# EAGLE design PHONE (EAGLE 6.5.0)
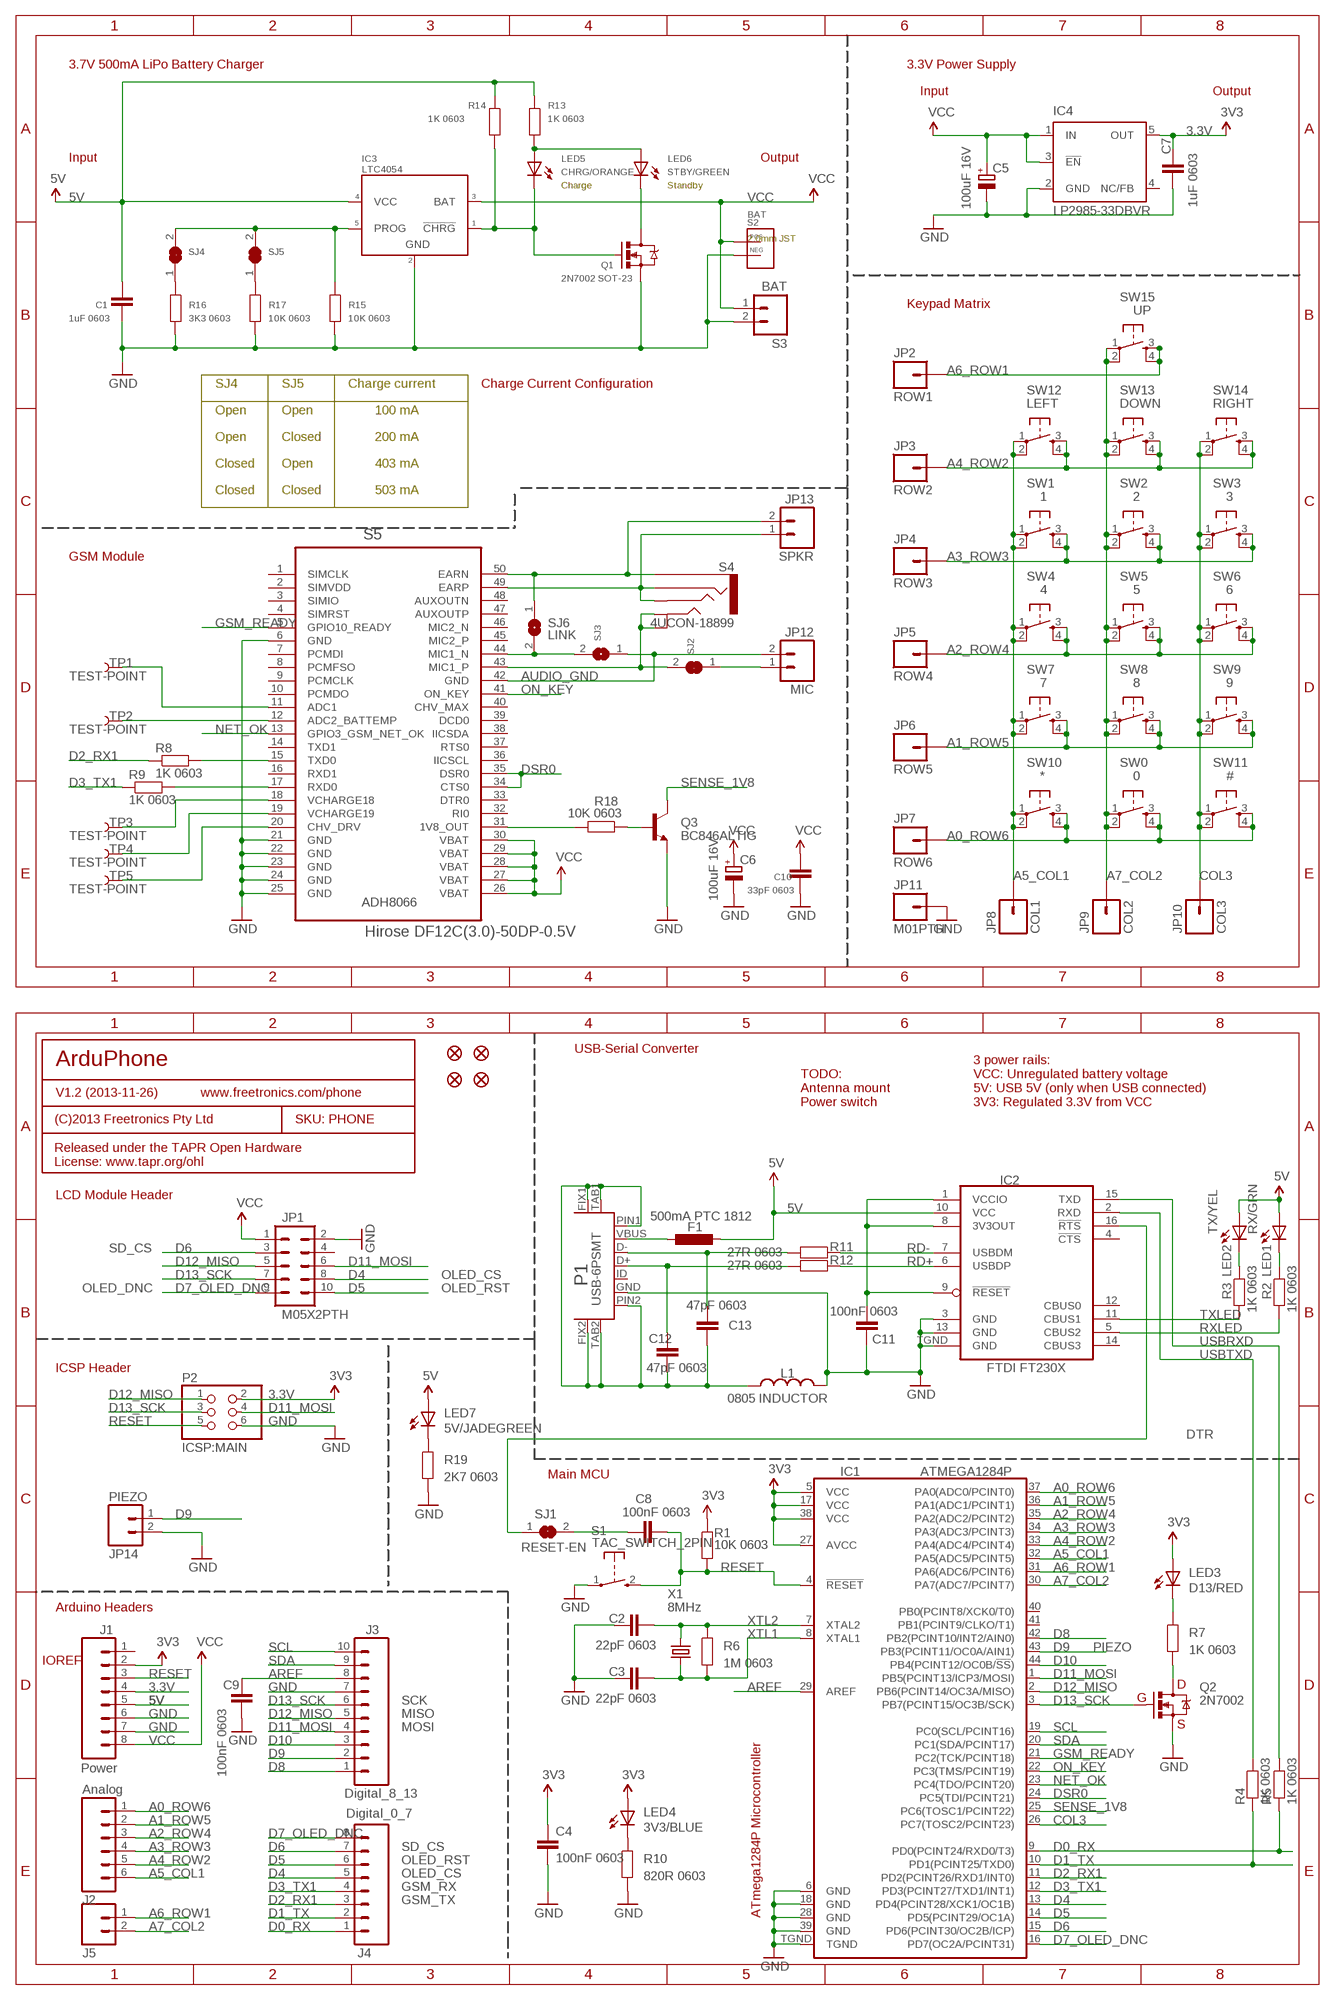
[diagram p0: schematic, sheet 1]

## Parts
C1  1uF 0603  CAP0603  [0603]
C2  22pF 0603  CAP0603  [0603]
C3  22pF 0603  CAP0603  [0603]
C4  100nF 0603  CAP0603  [0603]
C5  100uF 16V  CPOL-EUD  [PANASONIC_D]
C6  100uF 16V  CPOL-EUD  [PANASONIC_D]
C7  1uF 0603  CAP0603  [0603]
C8  100nF 0603  CAP0603  [0603]
C9  100nF 0603  CAP0603  [0603]
C10  33pF 0603  CAP0603  [0603@1]
C11  100nF 0603  CAP0603  [0603]
C12  47pF 0603  C-EUC0603  [C0603]
C13  47pF 0603  C-EUC0603  [C0603]
F1  500mA PTC 1812  L-EUL1812  [L1812]
IC1  ATMEGA1284P  [QFN-44M1]
IC2  FT230X  [QFN-16]
IC3  LTC4054  [SOT23-5]
IC4  LP2985-33DBVR  TEXAS_TPS77033  [TEXAS_SOT23-DBV]
J1  Power  M08  [1X08]
J2  Analog  M06SIP  [1X06]
J3  Digital_8_13  M100.1  [1X10]
J4  Digital_0_7  M08  [1X08]
J5  M02PTH  [1X02]
JP1  M05X2PTH  [AVR_ICSP]
JP2  ROW1  M01PTH  [1X01]
JP3  ROW2  M01PTH  [1X01]
JP4  ROW3  M01PTH  [1X01]
JP5  ROW4  M01PTH  [1X01]
JP6  ROW5  M01PTH  [1X01]
JP7  ROW6  M01PTH  [1X01]
JP8  COL1  M01PTH  [1X01]
JP9  COL2  M01PTH  [1X01]
JP10  COL3  M01PTH  [1X01]
JP11  M01PTH  [1X01]
JP12  MIC  M02PTH  [1X02]
JP13  SPKR  M02PTH  [1X02]
JP14  PIEZO  M02PTH  [1X02]
L1  0805 INDUCTOR  INDUCTOR0805-LARGE  [0805-LARGE]
LED1  RX/GRN  LED0603  [LED-0603]
LED2  TX/YEL  LED0603  [LED-0603]
LED3  D13/RED  LED0603  [LED-0603]
LED4  3V3/BLUE  LED0603  [LED-0603]
LED5  CHRG/ORANGE  LED0603  [LED-0603]
LED6  STBY/GREEN  LED0603  [LED-0603]
LED7  5V/JADEGREEN  LED0603  [LED-0603]
P1  USB-6PSMT  [USB-MICROB-MB05PMXX]
P2  ICSP:MAIN  PINHD-2X3  [2X03]
Q1  2N7002 SOT-23  2N7002  [SOT23-3]
Q2  2N7002  MOSFET-NCHANNELSMD  [SOT23-3]
Q3  BC846ALTIG  TRANSISTOR_NPNSOT23-3  [SOT23-3]
R1  10K 0603  RESISTOR0603  [0603]
R2  1K 0603  RESISTOR0603  [0603]
R3  1K 0603  RESISTOR0603  [0603]
R4  1K 0603  RESISTOR0603  [0603]
R5  1K 0603  RESISTOR0603  [0603]
R6  1M 0603  RESISTOR0603  [0603]
R7  1K 0603  RESISTOR0603  [0603]
R8  1K 0603  RESISTOR0603  [0603]
R9  1K 0603  RESISTOR0603  [0603]
R10  820R 0603  RESISTOR0603  [0603]
R11  27R 0603  RESISTOR0603  [0603]
R12  27R 0603  RESISTOR0603  [0603]
R13  1K 0603  RESISTOR0603  [0603]
R14  1K 0603  RESISTOR0603  [0603]
R15  10K 0603  RESISTOR0603  [0603]
R16  3K3 0603  RESISTOR0603  [0603]
R17  10K 0603  RESISTOR0603  [0603]
R18  10K 0603  RESISTOR0603  [0603]
R19  2K7 0603  RESISTOR0603  [0603]
S1  TAC_SWITCH_2PIN  [TACTILE_SWITCH_SMD_2PIN_TINY]
S2  BAT  2P-JST-TH-RAPTH  [JST-2MM-TH-RA]
S3  BAT  M02PTH  [1X02]
S4  4UCON-18899  AUDIO-JACK-4POLE  [4UCON-18899]
S5  Hirose DF12C(3.0)-50DP-0.5V  ADH8066  [ADH8066]
SJ1  RESET-EN  SJCN  [SJC]
SJ2  SJCN  [SJC]
SJ3  SJ  [SJ]
SJ4  SJCN  [SJC]
SJ5  SJCN  [SJC]
SJ6  LINK  SJ  [SJ]
SW0  0  TAC_SWITCHPTH  [TACTILE-PTH]
SW1  1  TAC_SWITCHPTH  [TACTILE-PTH]
SW2  2  TAC_SWITCHPTH  [TACTILE-PTH]
SW3  3  TAC_SWITCHPTH  [TACTILE-PTH]
SW4  4  TAC_SWITCHPTH  [TACTILE-PTH]
SW5  5  TAC_SWITCHPTH  [TACTILE-PTH]
SW6  6  TAC_SWITCHPTH  [TACTILE-PTH]
SW7  7  TAC_SWITCHPTH  [TACTILE-PTH]
SW8  8  TAC_SWITCHPTH  [TACTILE-PTH]
SW9  9  TAC_SWITCHPTH  [TACTILE-PTH]
SW10  *  TAC_SWITCHPTH  [TACTILE-PTH]
SW11  #  TAC_SWITCHPTH  [TACTILE-PTH]
SW12  LEFT  TAC_SWITCHPTH  [TACTILE-PTH]
SW13  DOWN  TAC_SWITCHPTH  [TACTILE-PTH]
SW14  RIGHT  TAC_SWITCHPTH  [TACTILE-PTH]
SW15  UP  TAC_SWITCHPTH  [TACTILE-PTH]
TP1  TEST-POINT  TEST-POINT2  [PAD.02X.02]
TP2  TEST-POINT  TEST-POINT2  [PAD.02X.02]
TP3  TEST-POINT  TEST-POINT2  [PAD.02X.02]
TP4  TEST-POINT  TEST-POINT2  [PAD.02X.02]
TP5  TEST-POINT  TEST-POINT2  [PAD.02X.02]
U$5  FIDUCIAL1X2.5  [FIDUCIAL-1X2.5]
U$6  FIDUCIAL1X2.5  [FIDUCIAL-1X2.5]
U$7  FIDUCIAL1X2.5  [FIDUCIAL-1X2.5]
U$14  FIDUCIAL1X2.5  [FIDUCIAL-1X2.5]
X1  8MHz  CRYSTALHC49UV  [HC49U-V]

## Nets
3.3V: C4.1 C7.2 IC1.5(VCC) IC1.17(VCC) IC1.27(AVCC) IC1.38(VCC) IC4.5(OUT) J1.2 J1.4 LED3.A LED4.A P2.2 R1.2 ; supply symbol labelled 3V3
5V: C1.2 F1.2 IC2.10(VCC) IC3.4(VCC) J1.5 LED1.A LED2.A LED7.A R13.1 R14.1
A0_ROW6: IC1.37(PA0(ADC0/PCINT0)) J2.1 JP7.1 SW0.3 SW0.4 SW10.3 SW10.4 SW11.3 SW11.4
A1_ROW5: IC1.36(PA1(ADC1/PCINT1)) J2.2 JP6.1 SW7.3 SW7.4 SW8.3 SW8.4 SW9.3 SW9.4
A2_ROW4: IC1.35(PA2(ADC2/PCINT2)) J2.3 JP5.1 SW4.3 SW4.4 SW5.3 SW5.4 SW6.3 SW6.4
A3_ROW3: IC1.34(PA3(ADC3/PCINT3)) J2.4 JP4.1 SW1.3 SW1.4 SW2.3 SW2.4 SW3.3 SW3.4
A4_ROW2: IC1.33(PA4(ADC4/PCINT4)) J2.5 JP3.1 SW12.3 SW12.4 SW13.3 SW13.4 SW14.3 SW14.4
A5_COL1: IC1.32(PA5(ADC5/PCINT5)) J2.6 JP8.1 SW1.1 SW1.2 SW4.1 SW4.2 SW7.1 SW7.2 SW10.1 SW10.2 SW12.1 SW12.2
A6_ROW1: IC1.31(PA6(ADC6/PCINT6)) J5.1 JP2.1 SW15.3 SW15.4
A7_COL2: IC1.30(PA7(ADC7/PCINT7)) J5.2 JP9.1 SW0.1 SW0.2 SW2.1 SW2.2 SW5.1 SW5.2 SW8.1 SW8.2 SW13.1 SW13.2 SW15.1 SW15.2
AREF: C9.1 IC1.29(AREF) J3.8
AUDIO_GND: JP12.2 S5.42(GND) SJ3.1
COL3: IC1.26(PC7(TOSC2/PCINT23)) JP10.1 SW3.1 SW3.2 SW6.1 SW6.2 SW9.1 SW9.2 SW11.1 SW11.2 SW14.1 SW14.2
D0_RX: IC1.9(PD0(PCINT24/RXD0/T3)) J4.1 R5.1
D1_TX: IC1.10(PD1(PCINT25/TXD0)) J4.2 R4.1
D2_RX1: IC1.11(PD2(PCINT26/RXD1/INT0)) J4.3 R8.1
D3_TX1: IC1.12(PD3(PCINT27/TXD1/INT1)) J4.4 R9.1
D4: IC1.13(PD4(PCINT28/XCK1/OC1B)) J4.5 JP1.8
D5: IC1.14(PD5(PCINT29/OC1A)) J4.6 JP1.10
D6: IC1.15(PD6(PCINT30/OC2B/ICP)) J4.7 JP1.3
D7_OLED_DNC: IC1.16(PD7(OC2A/PCINT31)) J4.8 JP1.9
D8: IC1.42(PB2(PCINT10/INT2/AIN0)) J3.1
D9: IC1.43(PB3(PCINT11/OC0A/AIN1)) J3.2 JP14.1
D10: IC1.44(PB4(PCINT12/OC0B/!SS!)) J3.3
D11_MOSI: IC1.1(PB5(PCINT13/ICP3/MOSI)) J3.4 JP1.6 P2.4
D12_MISO: IC1.2(PB6(PCINT14/OC3A/MISO)) J3.5 JP1.5 P2.1
D13_SCK: IC1.3(PB7(PCINT15/OC3B/SCK)) J3.6 JP1.7 P2.3 Q2.1(G)
DSR0: IC1.24(PC5(TDI/PCINT21)) S5.34(CTS0) S5.35(DSR0)
DTR: IC2.16(!RTS) SJ1.1
GND: C1.1 C2.1 C3.1 C4.2 C5.- C6.- C7.1 C9.2 C10.1 C11.2 IC1.6(GND) IC1.18(GND) IC1.28(GND) IC1.39(GND) IC1.TGND IC2.3(GND) IC2.13(GND) IC2.TGND(GND) IC3.2(GND) IC4.2(GND) J1.6 J1.7 J3.7 JP1.2 JP11.1 JP14.2 L1.2 P1.GND P2.6 Q1.2(S) Q2.2(S) Q3.2(E) R10.1 R15.2 R16.2 R17.2 R19.1 S1.1(P) S2.NEG S3.2 S5.6(GND) S5.21(GND) S5.22(GND) S5.23(GND) S5.24(GND) S5.25(GND)
GSM_READY: IC1.21(PC2(TCK/PCINT18)) S5.5(GPIO10_READY)
N$1: C8.1 SJ1.2
N$2: C11.1 IC2.1(VCCIO) IC2.8(3V3OUT) IC2.9(!RESET)
N$3: C12.2 C13.2 L1.1 P1.FIX1 P1.FIX2 P1.PIN1 P1.PIN2 P1.TAB1 P1.TAB2
N$4: LED3.C R7.2
N$5: LED6.C Q1.3(D)
N$6: Q2.3(D) R7.1
N$7: LED7.C R19.2
N$8: LED5.A LED6.A R13.2
N$9: S4.2A S4.2B S5.43(MIC1_P) SJ2.2
N$10: IC3.1(!CHRG) LED5.C Q1.1(G) R14.2
N$11: LED1.C R2.2
N$12: IC3.5(PROG) R15.1 SJ4.2 SJ5.2
N$13: LED2.C R3.2
N$14: LED4.C R10.2
N$15: Q3.1(B) R18.1
N$16: C12.1 P1.D+ R12.2
N$17: C13.1 P1.D- R11.2
N$18: S5.44(MIC1_N) SJ3.2 SJ6.2
N$19: JP13.2 S4.1 S5.50(EARN) SJ6.1
N$20: JP13.1 S4.3 S4.4 S5.49(EARP)
N$21: R8.2 S5.15(TXD0)
N$22: R9.2 S5.17(RXD0)
N$23: S5.18(VCHARGE18) TP3.P$1
N$24: S5.19(VCHARGE19) TP4.P$1
N$25: S5.20(CHV_DRV) TP5.P$1
N$26: R18.2 S5.31(1V8_OUT)
N$27: JP12.1 SJ2.1
N$30: S5.11(ADC1) TP1.P$1
N$31: S5.12(ADC2_BATTEMP) TP2.P$1
N$33: R16.1 SJ4.1
N$34: R17.1 SJ5.1
N$115: F1.1 P1.VBUS
NET_OK: IC1.23(PC4(TDO/PCINT20)) S5.13(GPIO3_GSM_NET_OK)
ON_KEY: IC1.22(PC3(TMS/PCINT19)) S5.41(ON_KEY)
RD+: IC2.6(USBDP) R12.1
RD-: IC2.7(USBDM) R11.1
RESET: C8.2 IC1.4(!RESET) J1.3 P2.5 R1.1 S1.2(S)
RXLED: IC2.5(CBUS2) R2.1
SCL: IC1.19(PC0(SCL/PCINT16)) J3.10
SDA: IC1.20(PC1(SDA/PCINT17)) J3.9
SENSE_1V8: IC1.25(PC6(TOSC1/PCINT22)) Q3.3(C)
TXLED: IC2.11(CBUS1) R3.1
USBRXD: IC2.15(TXD) R5.2
USBTXD: IC2.2(RXD) R4.2
VCC: C5.+ C6.+ C10.2 IC3.3(BAT) IC4.1(IN) IC4.3(!EN) J1.8 JP1.1 S2.POS S3.1 S5.26(VBAT) S5.27(VBAT) S5.28(VBAT) S5.29(VBAT) S5.30(VBAT)
XTL1: C3.2 IC1.8(XTAL1) R6.1 X1.1
XTL2: C2.2 IC1.7(XTAL2) R6.2 X1.2
Unconnected: IC1.40(PB0(PCINT8/XCK0/T0)) IC1.41(PB1(PCINT9/CLKO/T1)) IC2.4(!CTS) IC2.12(CBUS0) IC2.14(CBUS3) IC4.4(NC/FB) J1.1 JP1.4 P1.ID S5.1(SIMCLK) S5.2(SIMVDD) S5.3(SIMIO) S5.4(SIMRST) S5.7(PCMDI) S5.8(PCMFSO) S5.9(PCMCLK) S5.10(PCMDO) S5.14(TXD1) S5.16(RXD1) S5.32(RI0) S5.33(DTR0) S5.36(IICSCL) S5.37(RTS0) S5.38(IICSDA) S5.39(DCD0) S5.40(CHV_MAX) S5.45(MIC2_P) S5.46(MIC2_N) S5.47(AUXOUTP) S5.48(AUXOUTN)

## Notes on the sheet
- 3.7V 500mA LiPo Battery Charger | 3.3V Power Supply
- Input | Output
- Input | Output
- Charge | Standby
- 2.0mm JST
- Keypad Matrix
- SJ4 | SJ5 | Charge current | Charge Current Configuration
- Open | Open | 100 mA
- Open | Closed | 200 mA
- Closed | Open | 403 mA
- Closed | Closed | 503 mA
- GSM Module
- ADH8066
- USB-Serial Converter
- ArduPhone
- V1.2 (2013-11-26) | www.freetronics.com/phone
- TODO:
  Antenna mount
  Power switch
- 3 power rails:
  VCC: Unregulated battery voltage
  5V: USB 5V (only when USB connected)
  3V3: Regulated 3.3V from VCC
- (C)2013 Freetronics Pty Ltd | SKU: PHONE
- Released under the TAPR Open Hardware
  License: www.tapr.org/ohl
- LCD Module Header
- SD_CS
- OLED_CS
- OLED_DNC | OLED_RST
- ICSP Header
- Main MCU
- Arduino Headers
- PIEZO
- IOREF
- D
- SCK | G
- MISO
- MOSI | S
- SD_CS
- OLED_RST
- OLED_CS
- GSM_RX
- GSM_TX
- ATmega1284P Microcontroller

## Library data of the parts
C1-C4 C7-C9 C11 = freetronics-master-v1.1:CAP: Capacitor Standard 0603 ceramic capacitor, and 0.1" leaded capacitor.
C5 C6 = rcl:CPOL-EU: POLARIZED CAPACITOR, European symbol
C10 = freetronics:CAP: Capacitor Standard 0603 ceramic capacitor, and 0.1" leaded capacitor.
C12 C13 = freetronics-jon:C-EU: CAPACITOR, European symbol
F1 = rcl:L-EU: INDUCTOR, European symbol
IC1 = freetronics-jon:ATMEGA1284P
IC2 = freetronics-jon:FT230X
IC3 = freetronics-luke:LTC4054: Linear Technologies LTC4054 Li-ion battery charger in SOT23-5. (Or equivalent device.) http://cds.linear.com/docs/Datasheet/405442xf.pdf
IC4 = freetronics-jon:TEXAS_TPS770*: ULTRALOW-POWER 50-mA LOW-DROPOUT LINEAR REGULATORS 50-mA Low-Dropout Regulator Source: http://focus.ti.com/lit/ds/symlink/tps77001.pdf
J1 J4 = freetronics:M08: Header 8 Standard 8-pin 0.1" header. Use with straight break away headers (SKU : PRT-00116), right angle break away headers (PRT-00553), swiss pins (PRT-00743), machine pins (PRT-00117), and female headers (PRT-00115).
J2 = freetronics:M06: Header 6 Standard 6-pin 0.1" header. Use with straight break away headers (SKU : PRT-00116), right angle break away headers (PRT-00553), swiss pins (PRT-00743), machine pins (PRT-00117), and female headers (PRT-00115). Molex polarized connector foot print use with SKU : PRT-08094 with associated crimp pins and housings. NOTES ON THE VARIANTS LOCK and LOCK_LONGPADS... This footprint was designed to help hold the alignment of a through-hole component (i.e. 6-pin header) while soldering it into place. You may notice that each hole has been shifted either up or down by 0.005 of an inch from it's more standard position (which is a perfectly straight line). This slight alteration caused the pins (the squares in the middle) to touch the edges of the holes. Because they are alternating, it causes a "brace" to hold the component in place. 0.005 has proven to be the perfect amount of "off-center" position when using our standard breakaway headers. Although looks a little odd when you look at the bare footprint, once you have a header in there, the alteration is very hard to notice. Also, if you push a header all the way into place, it is covered up entirely on the bottom side. This idea of altering the position of holes to aid alignment will be further integrated into the Sparkfun Library for other footprints. It can help hold any component with 3 or more connection pins.
J3 = freetronics-original:M10: Header 10 Standard 10-pin 0.1" header. Use with straight break away headers (SKU : PRT-00116), right angle break away headers (PRT-00553), swiss pins (PRT-00743), machine pins (PRT-00117), and female headers (PRT-00115).
J5 JP12-JP14 S3 = freetronics-master-v1.1:M02: Header 2 Standard 2-pin 0.1" header. Use with straight break away headers (SKU : PRT-00116), right angle break away headers (PRT-00553), swiss pins (PRT-00743), machine pins (PRT-00117), and female headers (PRT-00115). Molex polarized connector foot print use with SKU : PRT-08233 with associated crimp pins and housings.
JP1 = freetronics-original:M05X2: Header 5x2 Standard 10-pin dual row 0.1" header. Commonly used with AVR-ISP. Use with Spark Fun Electronics SKU: PRT-00778
JP2-JP10 = freetronics-master-v1.1:M01: Header 1 Standard 1-pin 0.1" header. Use with straight break away headers (SKU : PRT-00116), right angle break away headers (PRT-00553), swiss pins (PRT-00743), machine pins (PRT-00117), and female headers (PRT-00115).
JP11 = freetronics-original:M01: Header 1 Standard 1-pin 0.1" header. Use with straight break away headers (SKU : PRT-00116), right angle break away headers (PRT-00553), swiss pins (PRT-00743), machine pins (PRT-00117), and female headers (PRT-00115).
L1 = freetronics-master-v1:INDUCTOR: Inductors Basic Inductor/Choke - 0603 and 1206. Footprints are not proven and vary greatly between part numbers.
LED1-LED7 = freetronics-master-v1:LED: LEDs Standard schematic elements and footprints for 5mm, 3mm, 1206, and 0603 sized LEDs. 5mm - Spark Fun Electronics SKU : COM-00529 (and others)
P1 = freetronics-jon:USB-6P
P2 = pinhead:PINHD-2X3: PIN HEADER
Q1 = freetronics-luke:2N7002: 2N7002 N-ch MOSFET in SOT-23.
Q2 = freetronics:MOSFET-NCHANNEL
Q3 = freetronics-original:TRANSISTOR_NPN: Transistor NPN BJT configuration in SOT23 package. MMBT2222 is the common NPN we use. Double check BCE configuration again layout.
R1-R19 = freetronics-master-v1.1:RESISTOR: Resistor Basic schematic elements and footprints for 0603, 1206, and PTH 1/10th watt (small) resistors.
S1 = freetronics-master-v1.1:TAC_SWITCH_2PIN: Momentary Tactile Switch - 2 pin
S2 = freetronics-jon:2P-JST-TH-RA: 2.0 mm pitch, through-hole 2-pin right-angle JST header, suitable for small Li-po batteries.
S4 = freetronics-jon:AUDIO-JACK-4POLE
S5 = freetronics-jon:ADH8066
SJ1 SJ2 SJ4 SJ5 = freetronics-jon:SJC
SJ3 SJ6 = freetronics-master-v1.1:SJ: SMD solder JUMPER
SW0 SW1-SW15 = freetronics-master-v1.1:TAC_SWITCH: Momentary Switch Button commonly used for reset or general input. Spark Fun Electronics SKU : COM-00097
TP1-TP5 = freetronics-original:TEST-POINT
U$5-U$7 U$14 = freetronics:FIDUCIAL: Fiducial Alignment Points Various fiducial points for machine vision alignment.
X1 = freetronics-master-v1:CRYSTAL: Crystals Various standard crystals. Proven footprints. Spark Fun Electronics SKU : COM-00534

## Board
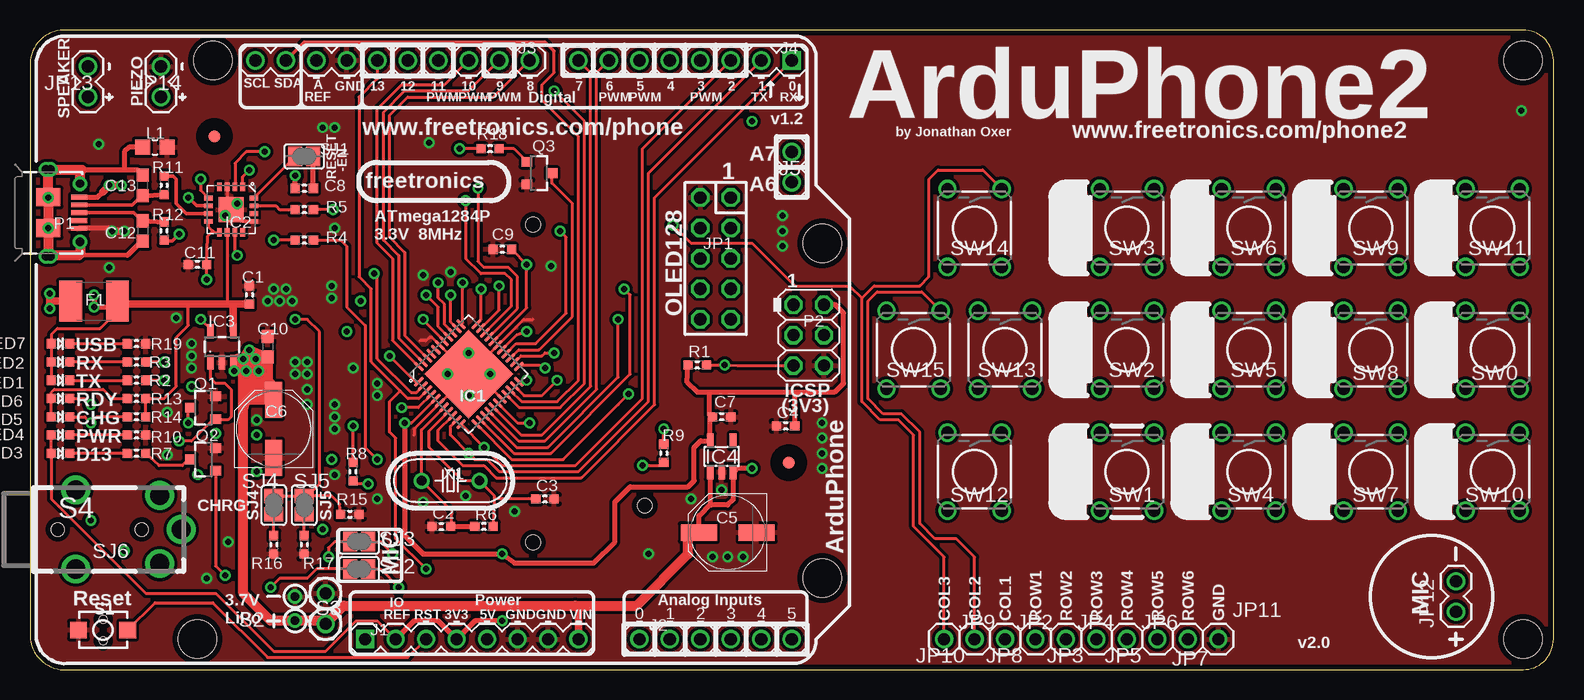
[diagram p1: board, top side]
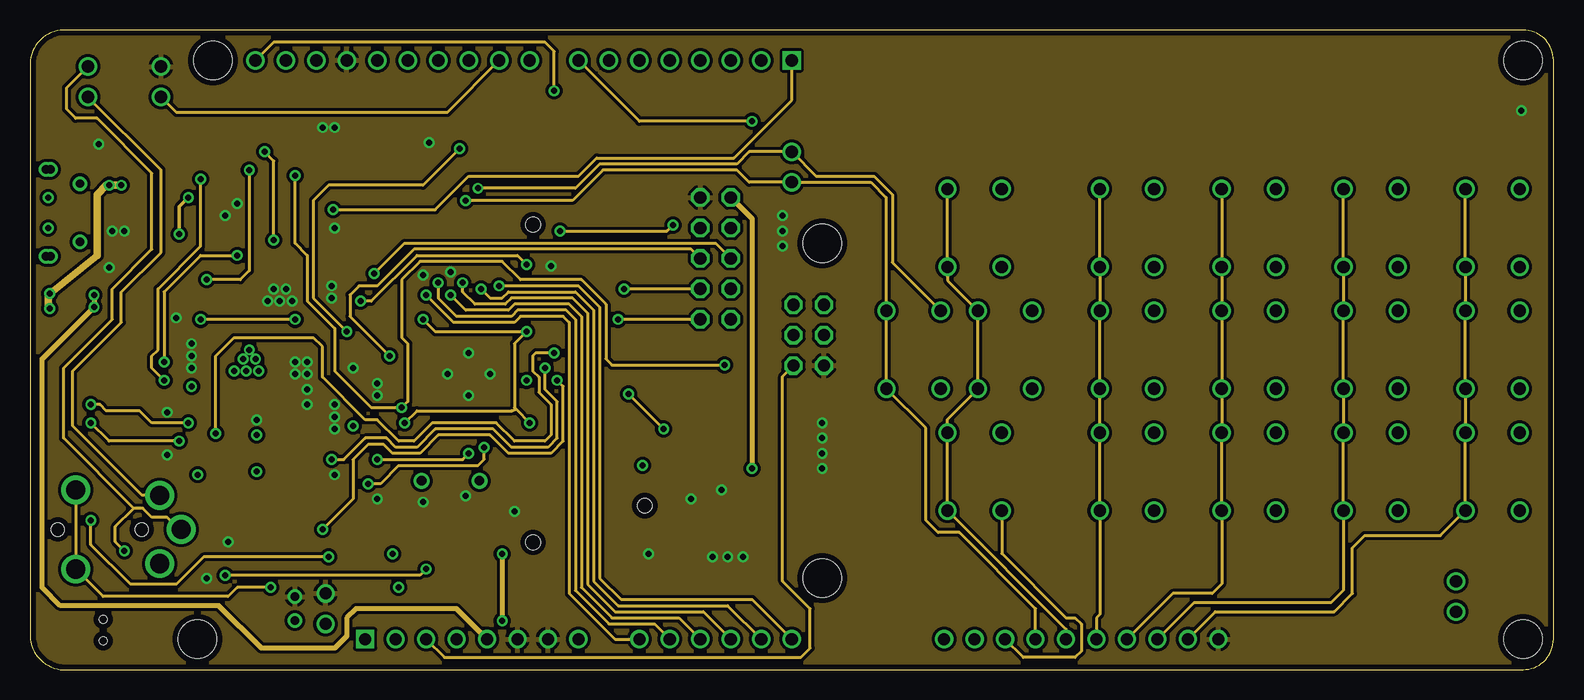
[diagram p2: board, inner layer Route2]
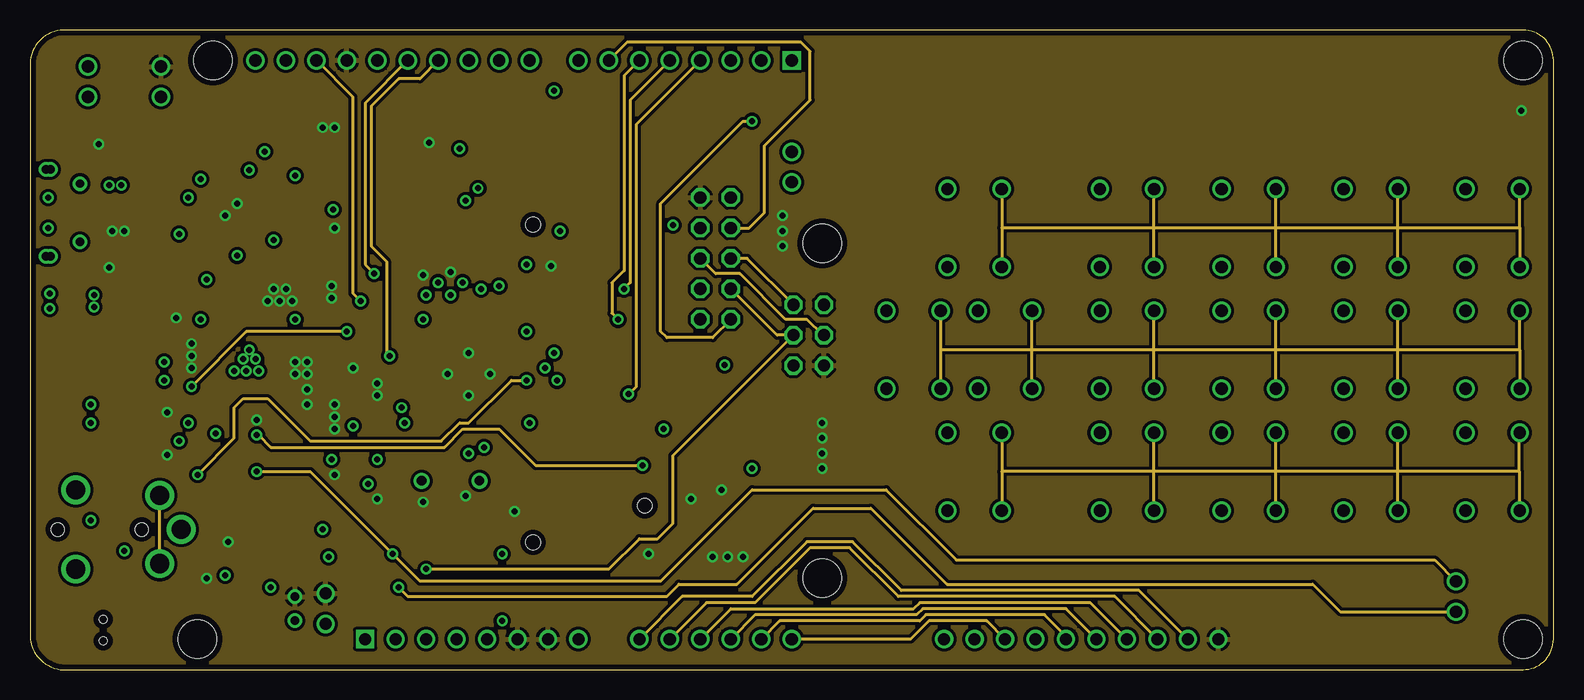
[diagram p3: board, inner layer Route15]
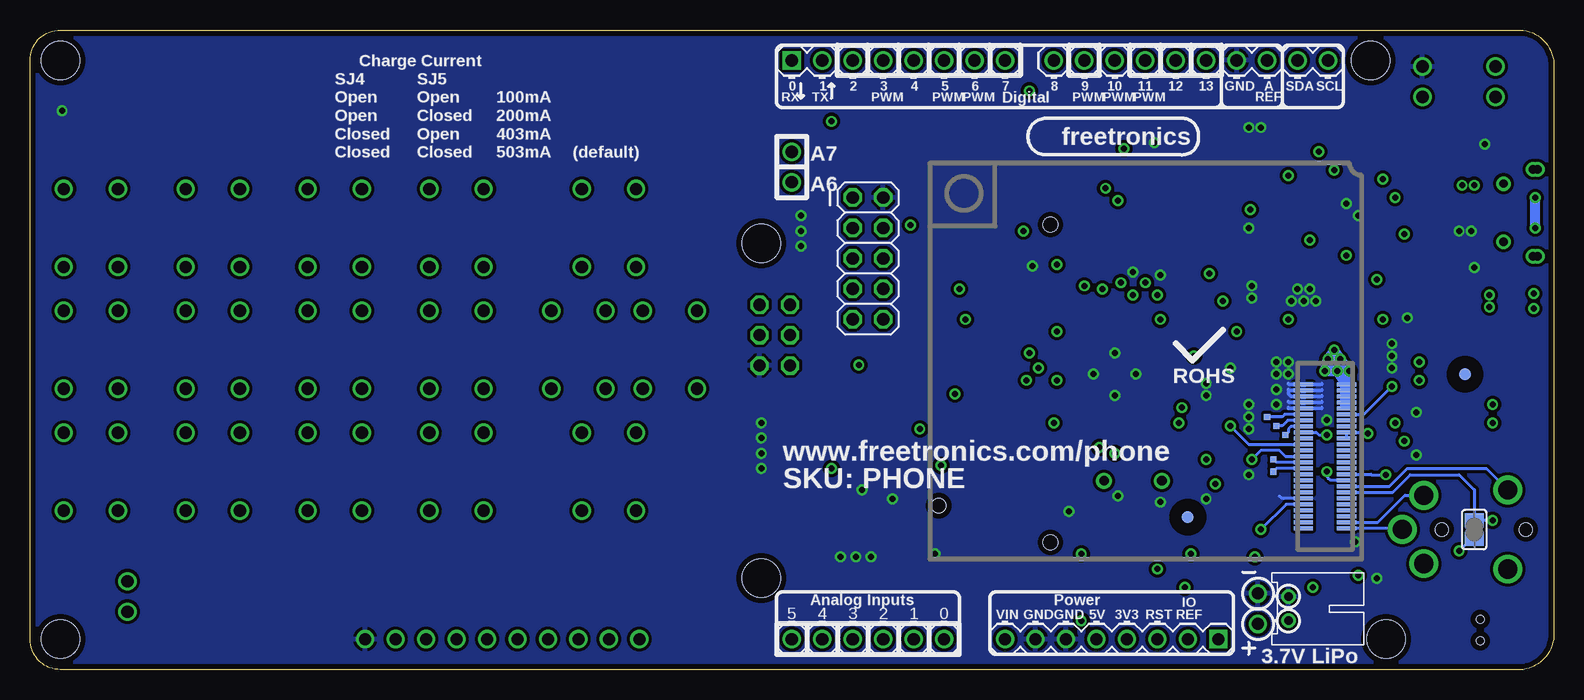
[diagram p4: board, bottom side, seen from below]

Size 127 x 53.34 mm. Coordinates in mm from the lower left corner, seen from the top.
Outline: 0,2.54 arc74 2.54,0 124.46,0 arc90 127,2.54 127,50.8 arc90 124.46,53.34 2.54,53.34 arc74 0,50.8 0,2.54
Copper layers (1+2*15+16): Top 0.035mm / dielectric 1.5mm / Route2 0.035mm / dielectric 0.15mm / Route15 0.035mm / dielectric 0.2mm / Bottom 0.035mm
Design rules "default *": minimum track width 10mil, minimum drill 18mil, track to track 10mil, track to pad 10mil, pad to pad 10mil, via to via 10mil, smd to smd 8mil, copper to edge 18mil, drill to drill 8mil, minimum pad ring 10mil, minimum via ring 8mil, stop-mask expansion 4mil, vias tented up to drill 25mil, thermal gap 10mil
Holes 3.2 mm at 66.04,35.56 66.04,7.62 15.24,50.8 13.97,2.54 124.46,50.8 124.46,2.54
tRestrict: area 14.4,43.4 to 16.4,45.5; area 62.2,16.3 to 64.3,18.3
bRestrict: area 29.5,11.7 to 31.5,13.7; area 6.3,23.6 to 8.4,25.7

### Footprints (pad centres in the part's own frame; a part is rotated, then mirrored left to right if it is on the bottom)
0603 = smd 0.762 x 0.762: 1 -0.762,0; 2 0.762,0
PANASONIC_D = smd 3 x 1.4: + 2.4,0; - -2.4,0
0603@1 = smd 1.1 x 1: 1 -0.85,0; 2 0.85,0
C0603 = smd 1.1 x 1: 1 -0.85,0; 2 0.85,0
L1812 = smd 1.9 x 3.4: 1 -1.95,0; 2 1.95,0
QFN-44M1 = smd 0.3 x 1.05: 1 -2.5,-3.4; 2 -2,-3.4; 3 -1.5,-3.4; 4 -1,-3.4; 5 -0.5,-3.4; 6 0,-3.4; 7 0.5,-3.4; 8 1,-3.4; 9 1.5,-3.4; 10 2,-3.4; 11 2.5,-3.4; 23 2.5,3.4; 24 2,3.4; 25 1.5,3.4; 26 1,3.4; 27 0.5,3.4; 28 0,3.4; 29 -0.5,3.4; 30 -1,3.4; 31 -1.5,3.4; 32 -2,3.4; 33 -2.5,3.4 | smd 1.05 x 0.3: 12 3.4,-2.5; 13 3.4,-2; 14 3.4,-1.5; 15 3.4,-1; 16 3.4,-0.5; 17 3.4,0; 18 3.4,0.5; 19 3.4,1; 20 3.4,1.5; 21 3.4,2; 22 3.4,2.5; 34 -3.4,2.5; 35 -3.4,2; 36 -3.4,1.5; 37 -3.4,1; 38 -3.4,0.5; 39 -3.4,0; 40 -3.4,-0.5; 41 -3.4,-1; 42 -3.4,-1.5; 43 -3.4,-2; 44 -3.4,-2.5 | smd 5.2 x 5.2: TGND 0,0
QFN-16 = smd 0.4 x 0.7: 1 -0.975,-1.9; 2 -0.325,-1.9; 3 0.325,-1.9; 4 0.975,-1.9; 9 0.975,1.9; 10 0.325,1.9; 11 -0.325,1.9; 12 -0.975,1.9 | smd 0.7 x 0.4: 5 1.9,-0.975; 6 1.9,-0.325; 7 1.9,0.325; 8 1.9,0.975; 13 -1.9,0.975; 14 -1.9,0.325; 15 -1.9,-0.325; 16 -1.9,-0.975 | smd 2.1 x 2.1: TGND 0,0
SOT23-5 = smd 0.55 x 1.2: 1 -0.95,-1.3; 2 0,-1.3; 3 0.95,-1.3; 4 0.95,1.3; 5 -0.95,1.3
TEXAS_SOT23-DBV = smd 0.55 x 1.2: 1 -0.95,-1.3; 2 0,-1.3; 3 0.95,-1.3; 4 0.95,1.3; 5 -0.95,1.3
1X08 = drill 1.016 square: 1 0,0 | drill 1.016: 2 2.54,0; 3 5.08,0; 4 7.62,0; 5 10.16,0; 6 12.7,0; 7 15.24,0; 8 17.78,0
1X06 = drill 1.016: 1 0,0; 2 2.54,0; 3 5.08,0; 4 7.62,0; 5 10.16,0; 6 12.7,0
1X10 = drill 1.016: 1 0,0; 2 2.54,0; 3 5.08,0; 4 7.62,0; 5 10.16,0; 6 12.7,0; 7 15.24,0; 8 17.78,0; 9 20.32,0; 10 22.86,0
1X02 = drill 1.016: 1 0,0; 2 2.54,0
AVR_ICSP = drill 1.016 octagon: 1 -1.27,5.08; 2 1.27,5.08; 3 -1.27,2.54; 4 1.27,2.54; 5 -1.27,0; 6 1.27,0; 7 -1.27,-2.54; 8 1.27,-2.54; 9 -1.27,-5.08; 10 1.27,-5.08
1X01 = drill 1.016: 1 0,0
0805-LARGE = smd 1.27 x 1.27: 1 -1.016,0; 2 1.016,0
LED-0603 = smd 0.762 x 0.762: A -0.762,0; C 0.762,0
USB-MICROB-MB05PMXX = smd 0.4 x 1.35: D+ 0,2.575; D- -0.65,2.575; GND 1.3,2.575; ID 0.65,2.575; VBUS -1.3,2.575 | smd 1.5 x 2: FIX1 -1.3,0; FIX2 1.3,0 | drill 0.7: PIN1 -2.425,2.65; PIN2 2.425,2.65; SLOT1 -3.625,-0.2; SLOT2 3.625,-0.2; TAB1 -3.625,0.2; TAB2 3.625,0.2
2X03 = drill 1.016 octagon: 1 -2.54,-1.27; 2 -2.54,1.27; 3 0,-1.27; 4 0,1.27; 5 2.54,-1.27; 6 2.54,1.27
SOT23-3 = smd 0.8 x 0.9: 1 -0.95,-1; 2 0.95,-1; 3 0,1.1
TACTILE_SWITCH_SMD_2PIN_TINY = smd 1.4 x 1.4: 1 -2.05,0; 2 2.05,0 | hole 0.65: 0,0.9; 0,-0.9
JST-2MM-TH-RA = drill 0.7: NEG -1,-3.81; POS 1,-3.81
4UCON-18899 = drill 1.6: 1 8.8,0; 2A 0,3.3; 2B 0,-3.3; 3 7,2.85; 4 7,-2.85 | hole 1.1: -1.5,0; 5.5,0
ADH8066 = smd 1.6 x 0.3: 1 1.8,6; 2 1.8,5.5; 3 1.8,5; 4 1.8,4.5; 5 1.8,4; 6 1.8,3.5; 7 1.8,3; 8 1.8,2.5; 9 1.8,2; 10 1.8,1.5; 11 1.8,1; 12 1.8,0.5; 13 1.8,0; 14 1.8,-0.5; 15 1.8,-1; 16 1.8,-1.5; 17 1.8,-2; 18 1.8,-2.5; 19 1.8,-3; 20 1.8,-3.5; 21 1.8,-4; 22 1.8,-4.5; 23 1.8,-5; 24 1.8,-5.5; 25 1.8,-6; 26 -1.8,-6; 27 -1.8,-5.5; 28 -1.8,-5; 29 -1.8,-4.5; 30 -1.8,-4; 31 -1.8,-3.5; 32 -1.8,-3; 33 -1.8,-2.5; 34 -1.8,-2; 35 -1.8,-1.5; 36 -1.8,-1; 37 -1.8,-0.5; 38 -1.8,0; 39 -1.8,0.5; 40 -1.8,1; 41 -1.8,1.5; 42 -1.8,2; 43 -1.8,2.5; 44 -1.8,3; 45 -1.8,3.5; 46 -1.8,4; 47 -1.8,4.5; 48 -1.8,5; 49 -1.8,5.5; 50 -1.8,6 | hole 1.2: 22.89,7.17; 22.89,-19.33; 32.19,4.12
SJC = smd 1.168 x 1.6: 1 -0.762,0; 2 0.762,0
SJ = smd 1.168 x 1.6: 1 -0.762,0; 2 0.762,0
TACTILE-PTH = drill 1.016: 1 -3.251,2.261; 2 3.251,2.261; 3 -3.251,-2.261; 4 3.251,-2.261
PAD.02X.02 = smd 0.508 x 0.508: P$1 0,0
FIDUCIAL-1X2.5 = smd 1 x 1: 1 0,0
HC49U-V = drill 0.813: 1 -2.413,0; 2 2.413,0

### Placement (x,y rotation side)
C1  18.29,31.24 270 top
C2  34.29,11.94 0 top
C3  42.93,14.22 180 top
C4  62.99,20.32 180 top
C5  58.17,11.43 180 top
C6  20.32,20.07 90 top
C7  57.66,21.08 180 top
C8  22.86,40.13 180 top
C9  39.37,35.05 180 top
C10  19.81,26.92 270 top
C11  13.97,33.78 180 top
C12  9.4,36.58 270 top
C13  9.4,40.39 90 top
F1  5.33,30.73 0 top
IC1  36.58,24.64 315 top
IC2  16.76,38.35 180 top
IC3  16,26.92 0 top
IC4  57.66,17.78 0 top
J1  27.94,2.54 0 top
J2  50.8,2.54 0 top
J3  41.66,50.8 180 top
J4  63.5,50.8 180 top
J5  63.5,40.64 90 top
JP1  57.15,34.29 0 bottom
JP2  83.82,2.54 180 top
JP3  86.36,2.54 180 top
JP4  88.9,2.54 180 top
JP5  91.44,2.54 180 top
JP6  93.98,2.54 90 top
JP7  96.52,2.54 90 top
JP8  81.28,2.54 180 top
JP9  78.74,2.54 180 top
JP10  76.2,2.54 180 top
JP11  99.06,2.54 0 top
JP12  118.87,4.83 90 top
JP13  4.83,47.75 90 top
JP14  10.92,47.75 90 top
L1  10.41,43.56 0 top
LED1  2.54,24.13 0 top
LED2  2.54,25.65 0 top
LED3  2.54,18.03 0 top
LED4  2.54,19.56 0 top
LED5  2.54,21.08 0 top
LED6  2.54,22.61 0 top
LED7  2.54,27.18 0 top
P1  1.52,38.1 270 top
P2  64.91,27.89 270 top
Q1  14.48,21.84 90 top
Q2  14.48,17.53 90 top
Q3  42.42,41.4 270 top
R1  55.63,25.4 180 top
R2  8.89,24.13 180 top
R3  8.89,25.65 180 top
R4  22.86,35.81 180 top
R5  22.86,38.35 180 top
R6  37.85,11.94 180 top
R7  8.89,18.03 180 top
R8  26.92,16.51 90 top
R9  52.83,18.03 270 top
R10  8.89,19.56 180 top
R11  11.18,40.39 270 top
R12  11.18,36.58 90 top
R13  8.89,22.61 180 top
R14  8.89,21.08 180 top
R15  26.67,12.95 0 top
R16  20.32,10.41 270 top
R17  22.86,10.41 270 top
R18  38.35,43.43 180 top
R19  8.89,27.18 180 top
S1  6.1,3.3 0 top
S2  18.29,5.08 270 bottom
S3  24.64,3.81 90 top
S4  3.81,11.68 0 top
S5  19.05,17.78 180 bottom
SJ1  22.86,42.8 0 top
SJ2  27.43,8.38 180 top
SJ3  27.43,10.67 180 top
SJ4  20.32,13.72 90 top
SJ5  22.86,13.72 90 top
SJ6  6.6,11.68 90 bottom
SW0  121.92,26.67 270 top
SW1  91.44,16.51 270 top
SW2  91.44,26.67 270 top
SW3  91.44,36.83 270 top
SW4  101.6,16.51 270 top
SW5  101.6,26.67 270 top
SW6  101.6,36.83 270 top
SW7  111.76,16.51 270 top
SW8  111.76,26.67 270 top
SW9  111.76,36.83 270 top
SW10  121.92,16.51 270 top
SW11  121.92,36.83 270 top
SW12  78.74,16.51 270 top
SW13  81.28,26.67 270 top
SW14  78.74,36.83 270 top
SW15  73.66,26.67 270 top
TP1  23.37,16.51 0 bottom
TP2  23.37,17.53 0 bottom
TP3  22.35,19.56 0 bottom
TP4  23.11,20.32 0 bottom
TP5  23.88,21.08 0 bottom
U$5  15.37,44.45 0 top
U$6  7.37,24.64 0 bottom
U$7  30.48,12.7 0 bottom
U$14  63.25,17.27 0 top
X1  35.05,15.75 180 top

### Tracks (layer width: path | path; a pad name or v marks a point on that pad's centre or on a via)
3.3V  (via drill 0.5)
  Top 0.254: IC1.17 40.64,20.57 v41.66,20.57 | v31.24,20.57 31.8,20.57 IC1.5 | LED4.A LED3.A 1.78,14.22 9.65,6.35 15.49,6.35 20.32,1.52 24.64,1.52 27.18,4.06 28.96,4.06 J1.2 | IC1.27 40.59,27.94 v41.4,28.19 | IC1.38 32.97,28.96 v32.77,29.21
  Top 0.406: P2.2 67.11,30.43 67.82,29.72 67.82,23.88 67.06,23.11 63.75,23.11 | J1.2 32,4.06 34.04,4.06 J1.4 37.08,4.06 v39.37,4.06 | 63.75,23.11 56.64,23.11 | 56.64,23.11 55.63,23.11 54.78,23.96 R1.2 | 56.64,23.11 56.64,21.25 C7.2 56.71,20.98 IC4.5 55.91,19.08 55.37,18.54 55.37,15.75 54.86,15.24 50.04,15.24 48.77,13.97 48.77,10.67 46.99,8.89 40.39,8.89 v39.37,9.65 32.77,9.65 31.24,11.18 v31.24,20.57 | C4.1 63.75,23.11
  Route2 0.254: v32.77,29.21 33.78,28.19 v41.4,28.19 40.39,27.18 40.39,21.84 40.51,21.72 | 40.51,21.72 v41.66,20.57 | v31.24,20.57 32.26,21.59 40.13,21.59 40.51,21.72
  Route2 0.406: v39.37,9.65 v39.37,4.06
5V  (via drill 0.5)
  Top 0.254: LED1.A LED2.A LED7.A 1.78,27.94 2.29,28.45 5.84,28.45 6.86,29.46 6.86,30.31 F1.2 | R14.1 R13.1 11.18,22.61 12.19,23.62 12.19,27.69 13.21,28.7 13.21,30.48 | IC2.10 16.44,30.55
  Top 0.305: 16.44,30.55 arc90 16.51,30.48
  Top 0.406: v5.33,31.24 v5.33,30.23 7.37,30.23 7.28,30.31 F1.2
  Top 0.61: F1.2 7.54,30.48 13.21,30.48 16.51,30.48 17.02,30.48 | IC3.4 16.95,30.41 arc-90 17.02,30.48 | 17.02,30.48 C1.2
  Route2 0.406: J1.5 35.56,5.08 27.18,5.08 26.42,4.32 26.42,2.79 25.4,1.78 19.3,1.78 15.75,5.33 2.54,5.33 1.02,6.86 1.02,25.91 v5.33,30.23 v5.33,31.24
A0_ROW6  (via drill 0.5)
  Top 0.254: IC1.37 34.04,28.59 34.04,30.23 v33.02,31.24
  Route2 0.254: v33.02,31.24 35.31,28.96 40.39,28.96 40.89,29.46 44.45,29.46 44.96,28.96 44.96,6.35 48.77,2.54 J2.1 | SW11.3 SW11.4 SW0.3 SW0.4 SW10.3 SW10.4 117.58,11.18 111.25,11.18 110.24,10.16 110.24,6.35 108.71,4.83 98.81,4.83 JP7.1
  Route15 0.254: JP7.1 92.46,6.6 72.64,6.6 68.58,10.67 64.77,10.67 60.2,6.1 54.36,6.1 J2.1
A1_ROW5  (via drill 0.5)
  Top 0.254: IC1.36 34.54,28.79 34.54,30.48 34.04,30.99 v34.04,32.26
  Route2 0.254: v34.04,32.26 34.04,30.99 35.56,29.46 40.13,29.46 40.64,29.97 44.7,29.97 45.47,29.21 45.47,6.6 48.26,3.81 52.07,3.81 J2.2 | SW9.3 SW9.4 SW8.3 SW8.4 SW7.3 SW7.4 109.5,6.63 108.46,5.59 97.03,5.59 JP6.1
  Route15 0.254: JP6.1 90.42,6.1 72.39,6.1 68.33,10.16 65.02,10.16 60.45,5.59 56.39,5.59 J2.2
A2_ROW4  (via drill 0.5)
  Top 0.254: IC1.35 35.05,28.99 v35.05,31.24
  Route2 0.254: J2.3 54.1,4.32 48.51,4.32 45.97,6.86 45.97,29.46 44.96,30.48 40.39,30.48 39.88,29.97 36.32,29.97 v35.05,31.24 | SW6.3 SW6.4 SW5.3 SW5.4 SW4.3 SW4.4 99.34,7.14 98.55,6.35 95.25,6.35 JP5.1
  Route15 0.254: JP5.1 88.39,5.59 74.17,5.59 73.66,5.08 58.42,5.08 J2.3
A3_ROW3  (via drill 0.5)
  Top 0.254: IC1.34 36.07,28.94 v36.07,32.26
  Route2 0.254: J2.4 56.13,4.83 48.77,4.83 46.48,7.11 46.48,29.72 45.21,30.99 40.13,30.99 39.62,30.48 37.08,30.48 36.07,31.5 v36.07,32.26 | SW3.3 SW3.4 SW2.3 SW2.4 SW1.3 SW1.4 89.18,4.6 88.9,4.32 JP4.1
  Route15 0.254: JP4.1 86.36,5.08 74.42,5.08 73.91,4.57 60.45,4.57 J2.4
A4_ROW2  (via drill 0.5)
  Top 0.254: IC1.33 37.59,29.19 v37.59,31.75
  Route2 0.254: J2.5 58.17,5.33 49.02,5.33 46.99,7.37 46.99,29.97 45.47,31.5 39.88,31.5 39.37,30.99 38.35,30.99 v37.59,31.75 | SW14.3 SW14.4 76.48,32.46 SW13.3 SW13.4 76.48,20.88 SW12.3 SW12.4 86.36,3.38 JP3.1
  Route15 0.254: J2.5 62.48,4.06 74.17,4.06 74.68,4.57 84.58,4.57 86.36,2.79 JP3.1
A5_COL1  (via drill 0.5)
  Top 0.254: IC1.32 39.12,30.01 v39.12,32
  Route2 0.254: J2.6 60.2,5.84 49.28,5.84 47.5,7.62 47.5,30.23 45.72,32 v39.12,32 | SW12.2 81,9.68 86.36,4.32 87.12,4.32 87.63,3.81 87.63,1.52 87.12,1.02 82.8,1.02 JP8.1
  Route15 0.254: SW7.2 114.02,16.51 | 114.02,16.51 SW7.1 | SW4.2 103.86,16.51 | 103.86,16.51 SW4.1 | SW1.2 93.7,16.51 | 93.7,16.51 SW1.1 | SW12.1 81,16.51 | 81,16.51 SW12.2 | 124.16,16.51 114.02,16.51 | 114.02,16.51 103.86,16.51 | 103.86,16.51 93.7,16.51 | 93.7,16.51 81,16.51 | J2.6 73.41,2.54 74.93,4.06 79.76,4.06 JP8.1 | 124.16,16.51 124.16,19.74 SW10.1 | 124.16,16.51 124.16,13.28 SW10.2
A6_ROW1  (via drill 0.5)
  Top 0.254: IC1.31 40.13,30.32 40.13,32.51 39.62,33.02 37.59,33.02 36.32,34.29 v36.32,39.12
  Route2 0.254: JP2.1 83.82,5.08 77.47,11.43 75.69,11.43 74.68,12.45 74.68,20.14 SW15.4 SW15.3 71.37,29.95 71.37,39.37 70.1,40.64 J5.1 59.94,40.64 58.93,41.66 47.75,41.66 45.21,39.12 v36.32,39.12
A7_COL2  (via drill 0.5)
  Top 0.254: IC1.30 40.64,30.12 40.64,32.77 39.88,33.53 37.85,33.53 37.34,34.04 v37.34,40.13 | JP9.1 78.74,9.4 77.22,10.92 75.44,10.92 74.17,12.19 74.17,19.81 72.64,21.34 71.12,21.34 69.85,22.61 69.85,30.73 70.61,31.5 74.35,31.5 SW15.1
  Route2 0.254: SW15.1 71.88,33.96 71.88,39.62 70.36,41.15 65.53,41.15 J5.2 59.94,43.18 58.93,42.16 47.5,42.16 45.47,40.13 v37.34,40.13
  Route15 0.254: SW8.2 114.02,26.67 | 114.02,26.67 SW8.1 | SW5.2 103.86,26.67 | 103.86,26.67 SW5.1 | SW2.2 93.7,26.67 | 93.7,26.67 SW2.1 | SW15.2 75.92,26.67 | 75.92,26.67 SW15.1 | SW13.2 83.54,26.67 | 83.54,26.67 SW13.1 | 124.18,26.67 114.02,26.67 | 114.02,26.67 103.86,26.67 | 103.86,26.67 93.7,26.67 | 93.7,26.67 83.54,26.67 | 83.54,26.67 75.92,26.67 | 124.18,26.67 SW0.1 | 124.18,26.67 SW0.2
AREF  (via drill 0.5)
  Top 0.254: C9.1 v41.4,33.78 41.4,30.17 IC1.29
  Route2 0.254: v41.4,33.78 40.64,34.54 32.26,34.54 28.45,30.73 v27.56,30.73
  Route15 0.254: v27.56,30.73 26.92,31.37 26.92,47.75 J3.8
AUDIO_GND  (via drill 0.5)
  Top 0.254: SJ3.1 29.21,10.67 v30.23,9.65
  Route15 0.254: JP12.2 117.09,9.14 77.22,9.14 71.37,14.99 60.2,14.99 52.58,7.37 32.51,7.37 v30.23,9.65 23.37,16.51 v18.9,16.51
  Bottom 0.254: S5.42 18.57,15.78 18.8,16 18.8,16.41 v18.9,16.51
COL3  (via drill 0.5)
  Top 0.254: JP10.1 76.2,9.4 73.66,11.94 73.66,19.56 72.39,20.83 70.87,20.83 69.34,22.35 69.34,30.99 | 69.34,30.99 70.36,32 74.17,32 74.93,32.77 74.93,40.89 75.69,41.66 79.43,41.66 SW14.1 | IC1.26 40.53,27.18 42.16,27.18 44.7,29.72 44.7,36.07 v44.2,36.58 | v53.59,37.08 55.12,35.56 60.2,35.56 63.75,32 68.33,32 69.34,30.99
  Route2 0.254: v44.2,36.58 53.09,36.58 v53.59,37.08
  Route15 0.254: SW9.2 114.02,36.83 | 114.02,36.83 SW9.1 | SW6.2 103.86,36.83 | 103.86,36.83 SW6.1 | SW3.2 93.7,36.83 | 93.7,36.83 SW3.1 | SW14.1 81,36.83 | 81,36.83 SW14.2 | 124.21,36.83 114.02,36.83 | 114.02,36.83 103.86,36.83 | 103.86,36.83 93.7,36.83 | 93.7,36.83 81,36.83 | 124.21,36.83 124.21,40.06 SW11.1 | 124.21,36.83 124.21,33.6 SW11.2
D0_RX  (via drill 0.5)
  Top 0.254: IC1.9 34.04,19.98 34.04,19.05 36.07,17.02 37.85,17.02 38.86,16 45.97,16 52.07,22.1 52.07,39.37 J4.1 | v25.27,38.35 R5.1
  Top 0.406: 23.75,38.39 R5.1
  Route2 0.254: v25.27,38.35 33.78,38.35 36.58,41.15 45.72,41.15 47.24,42.67 58.67,42.67 63.5,47.5 J4.1
D1_TX  (via drill 0.5)
  Top 0.254: IC1.10 35.05,20.29 35.05,19.56 v36.58,18.03 37.08,17.53 38.1,17.53 39.12,16.51 45.72,16.51 51.56,22.35 51.56,41.4 J4.2 | R4.1 25.91,35.81 26.42,35.31 26.42,30.23 27.94,28.7 27.94,18.54 v28.96,17.53
  Route2 0.254: v28.96,17.53 36.07,17.53 v36.58,18.03
D2_RX1  (via drill 0.5)
  Top 0.254: J4.3 51.05,43.43 51.05,22.61 45.47,17.02 39.37,17.02 v37.85,18.54 IC1.11 | v28.19,15.49 27.09,15.49 arc-90 R8.1
  Route2 0.254: v37.85,18.54 37.85,17.54 37.34,17.02 30.73,17.02 29.21,15.49 v28.19,15.49
D3_TX1  (via drill 0.5)
  Top 0.254: IC1.12 40.15,17.53 44.45,17.53 v49.91,22.99 49.02,22.1 | 52.74,18.8 R9.1 v52.83,20.07
  Route2 0.254: v52.83,20.07 v49.91,22.99
  Route15 0.254: v49.91,22.99 50.55,23.62 50.55,45.47 J4.4
D4  (via drill 0.5)
  Top 0.254: IC1.13 40.35,18.03 43.43,18.03 50.04,24.64 50.04,31.24 v49.53,31.75
  Route2 0.254: JP1.8 v49.53,31.75
  Route15 0.254: J4.5 50.04,47.5 50.04,32.26 v49.53,31.75
D5  (via drill 0.5)
  Top 0.254: v49.02,29.21 49.02,24.38 43.18,18.54 40.55,18.54 IC1.14
  Route2 0.254: JP1.10 v49.02,29.21
  Route15 0.254: J4.6 49.53,49.53 49.53,33.27 48.51,32.26 48.51,29.72 v49.02,29.21
D6
  Top 0.254: J4.7 47.24,49.78 47.24,23.37 42.93,19.05 40.75,19.05 IC1.15
  Route15 0.254: JP1.3 59.94,36.83 61.21,38.1 61.21,43.69 65.02,47.5 65.02,51.56 64.26,52.32 49.78,52.32 J4.7
D7_OLED_DNC  (via drill 0.5)
  Top 0.254: J4.8 46.74,49.78 46.74,23.62 42.67,19.56 40.95,19.56 IC1.16
  Route2 0.254: v60.2,45.72 50.8,45.72 J4.8
  Route15 0.254: JP1.9 56.9,27.69 53.09,27.69 52.58,28.19 52.58,38.86 59.44,45.72 v60.2,45.72
D8
  Top 0.254: IC1.42 31.24,27.85 31.24,34.8 29.97,36.07 29.97,46.23 31.5,47.75 38.61,47.75 J3.1
D9
  Top 0.254: IC1.43 30.73,27.65 30.73,34.54 29.46,35.81 29.46,46.48 31.24,48.26 36.58,48.26 J3.2
  Route2 0.254: J3.2 34.8,46.48 12.19,46.48 JP14.1
D10
  Top 0.254: IC1.44 30.23,27.45 30.23,34.29 28.96,35.56 28.96,46.74 30.99,48.77 34.54,48.77 J3.3
D11_MOSI  (via drill 0.5)
  Top 0.254: v29.97,26.16 32.13,24 IC1.1 | P2.4 v66.09,27.89
  Route2 0.254: v29.97,26.16 26.67,29.46 26.67,31.24 27.43,32 28.96,32 32,35.05 55.12,35.05 JP1.6
  Route15 0.254: v29.97,26.16 29.72,26.42 29.72,34.04 28.45,35.31 28.45,46.99 30.73,49.28 32.51,49.28 J3.4 | v66.09,27.89 64.77,29.21 62.99,29.21 59.18,33.02 57.15,33.02 JP1.6
D12_MISO  (via drill 0.5)
  Top 0.254: v28.7,33.02 28.96,32.77 28.96,25.91 31.75,23.11 32.22,23.11 IC1.2
  Route2 0.254: v28.7,33.02 31.24,35.56 57.15,35.56 JP1.5
  Route15 0.254: J3.5 27.94,47.24 27.94,33.78 v28.7,33.02 | P2.1 59.78,34.29 JP1.5
D13_SCK  (via drill 0.5)
  Top 0.254: IC1.3 32.42,22.61 31.5,22.61 30.86,23.24 | 30.86,23.24 28.45,25.65 28.45,31.75 27.43,32.77 27.43,47.75 28.96,49.28 J3.6 | 30.86,23.24 29.97,22.35 29.97,19.81 30.48,19.3 30.48,10.92 v33.02,8.38 | Q2.1 15.48,8.65 v16.26,7.87
  Route2 0.254: v33.02,8.38 32.51,7.87 v16.26,7.87
  Route15 0.254: JP1.7 62.28,27.89 P2.3 53.59,17.84 53.59,12.19 52.32,10.92 50.8,10.92 48.26,8.38 v33.02,8.38
DSR0  (via drill 0.5)
  Top 0.254: IC1.24 40.93,26.16 42.67,26.16 42.93,26.42 v43.69,26.42
  Route2 0.254: v15.49,19.68 15.49,26.16 17.02,27.69 23.62,27.69 24.38,26.92 24.38,24.38 27.94,20.83 28.96,20.83 30.73,19.05 32,19.05 33.53,20.57 38.86,20.57 40.39,19.05 42.93,19.05 43.43,19.56 43.43,22.1 42.42,23.11 42.42,24.38 41.91,24.89 41.91,26.16 42.16,26.42 v43.69,26.42
  Bottom 0.254: S5.35 S5.34 15.78,19.78 v15.49,19.68
DTR
  Top 0.254: 22.1,42.42 SJ1.1 22.1,42.76 IC2.16
GND  (via drill 0.5)
  Top 0.254: IC1.18 38.35,23.57 v38.35,24.64 | v36.58,22.86 IC1.TGND v36.58,26.42 37.85,25.91 IC1.28 41.15,29.21 41.91,29.21 | 32.51,27.43 33.02,27.43 33.27,27.69 33.53,27.69 IC1.39 34.8,26.42 v34.8,24.64 34.8,22.86 IC1.6 32,20.07 32,19.56 | IC2.3 16.44,38.68 arc90 IC2.TGND arc90 17.74,37.38 IC2.13
  Top 0.406: v6.86,36.58 6.63,36.8 P1.GND
  Top 0.61: v6.86,36.58 v7.87,36.58
  Bottom 0.254: S5.6 22.66,14.28 22.86,14.48
  Bottom 0.305: 19.3,23.88 19.3,23.78 S5.25 22,23.78 arc90 22.1,23.88 | 19.3,23.37 19.3,23.28 S5.24 22.01,23.28 arc90 22.1,23.37 | 19.3,22.86 19.3,22.78 S5.23 21.76,22.78 arc90 22.1,23.11 | 19.3,22.35 19.3,22.28 S5.22 22.03,22.28 arc90 22.1,22.35 | 19.3,21.84 19.3,21.78 S5.21 22.1,21.78 22.1,21.84
  other vias: 32.77,32.89 5.71,43.81 124.33,46.61 6.6,33.53 28.96,23.88 36.32,14.48 33.27,43.94 62.74,36.58 62.74,37.85 62.74,35.31 40.39,13.21 28.96,22.86 32.77,13.97 28.96,14.22 11.43,21.46 11.43,17.91 57.66,14.99 14.73,7.62 21.84,30.73 18.9,20.83 23.11,22.1 23.11,25.65 23.11,24.64 25.4,22.1 23.11,23.37 25.4,20.07 25.4,21.08 26.92,25.15 25.15,30.99 25.15,32 35.05,33.15 43.43,33.66 25.4,16.26 66.04,16.76 66.04,19.3 66.04,20.57 66.04,18.03 17.27,38.86 16.26,37.85 12.19,29.34 20.83,30.73 19.81,30.73 21.34,31.75 20.32,31.75 13.46,27.18 13.46,26.16 13.46,25.15 25.4,36.83 25.4,45.21 24.38,45.21 59.44,9.4 58.17,9.4 56.9,9.4 16.51,10.67 55.12,14.22 51.56,9.65 22.1,24.64 22.1,25.65
  pour Bottom: 0,50.8 arc-74 2.54,53.34 124.46,53.34 arc-74 127,50.8 127,2.54 arc-74 124.46,0 2.54,0 arc-74 0,2.54
  pour Top: 0,50.8 arc-74 2.54,53.34 124.46,53.34 arc-74 127,50.8 127,2.54 arc-74 124.46,0 2.54,0 arc-74 0,2.54
  pour Route2: 0,50.8 arc-74 2.54,53.34 124.46,53.34 arc-74 127,50.8 127,2.54 arc-74 124.46,0 2.54,0 arc-74 0,2.54
  pour Route15: 0,50.8 arc-74 2.54,53.34 124.46,53.34 arc-74 127,50.8 127,2.54 arc-74 124.46,0 2.54,0 arc-74 0,2.54
GSM_READY  (via drill 0.5)
  Top 0.254: IC1.21 41.18,22.86 42.67,22.86 v43.94,24.13
  Route2 0.254: v43.94,24.13 44.45,23.62 44.45,19.05 43.43,18.03 39.88,18.03 38.35,19.56 34.04,19.56 32.51,18.03 30.23,18.03 29.46,18.8 28.19,18.8 26.92,17.53 26.92,14.22 v24.38,11.68
  Bottom 0.254: S5.5 22.29,13.78 v24.38,11.68
N$1
  Top 0.406: C8.1 23.62,40.22 SJ1.2
N$2  (via drill 0.5)
  Top 0.254: IC2.8 14.86,36.95 15.24,36.58 | 15.24,36.58 15.36,36.45 IC2.9 | 15.24,36.58 14.82,36.16 C11.1 14.73,33.69 v14.73,32.51 | IC2.1 17.74,41.11 v18.29,41.66
  Route2 0.254: v18.29,41.66 18.29,33.27 17.53,32.51 v14.73,32.51
N$3  (via drill 0.5)
  Top 0.406: C12.2 9.14,35.56 8.14,34.55 4.07,34.55 4.17,34.66 | C13.2 8.98,41.66 7.87,41.66 | 7.87,41.66 4.32,41.66 4.17,41.51 | 1.52,41.52 P1.TAB1 | 1.52,34.67 P1.TAB2 1.79,34.54 | 1.52,41.92 P1.TAB1 | 1.79,41.66 P1.TAB1 | L1.1 8.26,43.56 7.87,43.18 7.87,41.66
  Top 0.813: 4.07,34.55 3.3,34.54 1.79,34.54 | 4.32,41.66 1.79,41.66 | 1.52,41.52 P1.FIX1 v1.52,39.37 v1.52,36.83 P1.FIX2 1.52,34.67 | P1.PIN1 4.17,41.51 | P1.PIN2 4.17,34.66
  Bottom 0.813: v1.52,36.83 v1.52,39.37
N$4
  Top 0.254: R7.2 LED3.C
N$5  (via drill 0.5)
  Top 0.254: LED6.C 4.57,22.61 v5.08,22.1 | v13.21,20.57 13.21,21.67 Q1.3
  Route2 0.254: v13.21,20.57 10.16,20.57 9.14,21.59 6.35,21.59 5.84,22.1 v5.08,22.1
N$6
  Top 0.254: Q2.3 13.21,17.53 12.7,17.02 10.76,17.02 R7.1
N$7
  Top 0.254: LED7.C R19.2
N$8
  Top 0.254: LED5.A LED6.A 1.78,23.11 2.03,23.37 6.1,23.37 6.86,22.61 R13.2
N$9  (via drill 0.5)
  Top 0.254: SJ2.2 23.88,8.38 23.11,7.62 20.83,7.62 v20.07,6.86
  Route2 0.254: S4.2A S4.2B 6.1,6.1 16.51,6.1 17.27,6.86 v20.07,6.86
  Bottom 0.254: S5.43 13.68,15.28 12.19,16.76 5.59,16.76 S4.2A
N$10  (via drill 0.5)
  Top 0.254: v12.45,19.05 13.46,19.05 15.31,20.89 Q1.1 15.54,20.83 16.51,20.83 16.76,21.08 16.76,23.37 16.26,23.88 15.49,23.88 15.05,24.32 IC3.1 | LED5.C 4.57,21.08 v5.08,20.57 5.59,21.08 R14.2
  Route2 0.254: v12.45,19.05 6.6,19.05 v5.08,20.57
N$11
  Top 0.254: LED1.C R2.2
N$12  (via drill 0.5)
  Top 0.254: SJ4.2 SJ5.2 | SJ5.2 22.86,14.22 24.13,15.49 24.13,28.19 23.11,29.21 v22.1,29.21 | v14.22,29.21 15.05,28.38 IC3.5 | R15.1 25.82,13.8 25.15,14.48 SJ5.2
  Route2 0.254: v22.1,29.21 v14.22,29.21
N$13
  Top 0.254: R3.2 LED2.C
N$14
  Top 0.254: R10.2 LED4.C
N$15
  Top 0.254: R18.1 40.34,43.43 Q3.1
N$16
  Top 0.305: 9.31,37.43 8.64,38.1 P1.D+
  Top 0.406: 9.31,37.43 C12.1 R12.2
N$17
  Top 0.305: 9.31,39.54 8.52,38.75 P1.D-
  Top 0.406: 9.31,39.54 C13.1 R11.2
N$18  (via drill 0.5)
  Top 0.254: SJ3.2 25.4,10.67 24.89,10.16 v24.89,9.4
  Route2 0.254: v24.89,9.4 14.48,9.4 12.19,7.11 8.38,7.11 5.08,10.41 v5.08,12.45
  Bottom 0.254: S5.44 13.41,14.78 11.94,16.26 7.87,16.26 6.6,14.99 SJ6.2 v5.08,12.45
N$19  (via drill 0.5)
  Route2 0.254: S4.1 12.45,11.68 11.43,12.7 10.16,12.7 9.4,13.46 8.64,13.46 | 8.64,13.46 2.79,19.3 2.79,25.15 6.86,29.21 6.86,31.75 10.16,35.05 10.16,41.4 5.59,45.97 3.81,45.97 3.05,46.74 3.05,48.51 JP13.2 | v7.87,9.91 7.11,10.67 7.11,11.94 8.64,13.46
  Bottom 0.254: S4.1 13.28,11.78 S5.50 | SJ6.1 6.86,10.92 v7.87,9.91
N$20
  Route2 0.254: S4.3 9.34,14.53 3.56,20.32 3.56,24.89 7.62,28.96 7.62,31.5 10.92,34.8 10.92,41.66 JP13.1
  Route15 0.254: S4.4 S4.3
  Bottom 0.254: S5.49 14.64,12.28 12.39,14.53 S4.3
N$21  (via drill 0.5)
  Top 0.254: 26.92,17.18 R8.2 v26.92,20.32
  Bottom 0.254: v26.92,20.32 25.4,18.8 20.87,18.8 S5.15
N$22  (via drill 0.5)
  Top 0.254: v51.05,17.02 52.67,17.02 R9.2
  Route15 0.254: v18.9,19.56 19.05,19.56 20.07,18.54 34.54,18.54 36.07,20.07 39.12,20.07 42.16,17.02 v51.05,17.02
  Bottom 0.254: S5.17 19.78,19.78 19.56,19.56 v18.9,19.56
N$23
  Bottom 0.254: S5.18 21.88,20.28 22.1,20.07 22.1,19.81 TP3.P$1
N$24
  Bottom 0.254: S5.19 22.15,20.78 22.61,20.32 TP4.P$1
N$25
  Bottom 0.254: S5.20 22.41,21.28 22.61,21.08 TP5.P$1
N$26  (via drill 0.5)
  Top 0.254: R18.2 v35.81,43.43
  Route2 0.254: v35.81,43.43 32.77,40.39 24.89,40.39 23.62,39.12 23.62,30.99 v26.42,28.19
  Route15 0.254: v26.42,28.19 18.03,28.19 v13.46,23.62
  Bottom 0.254: v13.46,23.62 15.8,21.28 S5.31
N$27  (via drill 0.5)
  Top 0.254: SJ2.1 29.21,8.38 v30.73,6.86
  Route15 0.254: JP12.1 109.22,4.83 106.93,7.11 76.45,7.11 70.1,13.46 65.28,13.46 58.93,7.11 54.1,7.11 53.09,6.1 31.5,6.1 v30.73,6.86
N$30
  Bottom 0.254: S5.11 23.1,16.78 TP1.P$1
N$31
  Bottom 0.254: S5.12 23.12,17.28 TP2.P$1
N$33
  Top 0.254: R16.1 SJ4.1
N$34
  Top 0.254: R17.1 SJ5.1
N$115  (via drill 0.5)
  Top 0.406: P1.VBUS 5.62,39.4 6.06,39.84
  Top 0.61: v7.62,40.39 v6.6,40.39 6.06,39.84 | 1.65,30.73 F1.1 | 1.65,30.73 v1.65,31.37 | v1.65,30.1 1.65,30.73
  Route2 0.61: v1.65,30.1 1.52,30.1 1.52,31.24 5.59,34.54 5.59,39.62 6.35,40.39 v6.6,40.39 v7.62,40.39
NET_OK  (via drill 0.5)
  Top 0.254: IC1.23 40.87,25.4 42.42,25.4 v42.93,25.15
  Route2 0.254: v42.93,25.15 42.93,23.37 43.94,22.35 43.94,19.3 43.18,18.54 40.13,18.54 38.61,20.07 33.78,20.07 32.26,18.54 30.48,18.54 29.72,19.3 27.94,19.3 26.16,17.53 v25.15,17.53
  Bottom 0.254: S5.13 22.35,17.78 22.86,18.29 24.38,18.29 v25.15,17.53
ON_KEY  (via drill 0.5)
  Top 0.254: IC1.22 40.88,23.88 v41.4,24.13
  Route15 0.254: v13.97,16.26 17.02,19.3 17.02,21.84 17.78,22.61 19.81,22.61 23.37,19.05 34.29,19.05 35.81,20.57 36.58,20.57 40.13,24.13 v41.4,24.13
  Bottom 0.254: S5.41 15.22,16.28 15.19,16.26 v13.97,16.26
RD+  (via drill 0.5)
  Top 0.254: R12.1 11.34,35.73
  Top 0.305: 11.34,35.73 11.85,35.73 v12.45,36.32 | v13.21,39.37 13.9,38.68 IC2.6
  Route2 0.305: v12.45,36.32 12.45,38.61 v13.21,39.37
RD-
  Top 0.305: R11.1 11.94,41.15 12.19,40.89 12.19,38.86 13.03,38.03 IC2.7
RESET  (via drill 0.5)
  Top 0.254: v22.1,41.2 22.01,41.12 | IC1.4 32.37,21.84 v30.99,21.84 | S1.2 10.43,5.59 15.24,5.59 19.81,1.02 31.5,1.02 J1.3 | R1.1 v57.91,25.4 58.98,25.35 P2.5
  Top 0.406: 22.01,41.12 C8.2
  Route2 0.254: v22.1,41.2 22.1,35.56 23.11,34.54 23.11,30.73 25.4,28.45 25.4,24.89 28.45,21.84 v30.99,21.84 31.5,22.35 31.5,27.18 30.99,27.69 30.99,32.51 32.51,34.04 39.37,34.04 40.89,32.51 45.97,32.51 48.01,30.48 48.01,25.91 48.51,25.4 v57.91,25.4 | J1.3 34.54,1.02 64.26,1.02 65.02,1.78 65.02,5.08 62.74,7.37 62.74,24.45 P2.5
  Bottom 0.254: P2.5 63.55,25.35
RXLED  (via drill 0.5)
  Top 0.254: v11.18,24.13 R2.1 | v14.22,40.89 14.22,39.97 IC2.5
  Route2 0.254: v11.18,24.13 10.16,25.15 10.16,26.16 10.67,26.67 10.67,31.75 14.22,35.31 v14.22,40.89
SCL  (via drill 0.5)
  Top 0.254: IC1.19 40.78,21.84 44.2,21.84 46.23,23.88 46.23,45.72 v43.69,48.26
  Route2 0.254: J3.10 20.32,52.32 42.93,52.32 43.69,51.56 v43.69,48.26
SDA
  Top 0.254: IC1.20 40.98,22.35 43.94,22.35 45.72,24.13 45.72,44.45 42.67,47.5 42.67,48.77 43.69,49.78 43.69,51.56
  Top 0.305: 43.69,51.56 42.93,52.32 22.86,52.32 J3.9
SENSE_1V8
  Top 0.254: IC1.25 40.73,26.67 42.42,26.67 45.21,29.46 45.21,38.86 43.52,40.56 Q3.3
TXLED  (via drill 0.5)
  Top 0.254: v11.18,25.65 R3.1 | v17.27,34.54 17.09,34.73 IC2.11
  Route2 0.254: v11.18,25.65 11.18,31.5 14.22,34.54 v17.27,34.54
USBRXD
  Top 0.254: 21.97,38.35 22.01,38.39 R5.2 20.83,38.35 20.5,38.68 IC2.15
USBTXD  (via drill 0.5)
  Top 0.254: R4.2 v20.32,35.81 | v19.56,43.18 18.03,43.18 17.09,42.23 IC2.2
  Route2 0.254: v20.32,35.81 20.32,42.42 v19.56,43.18
VCC  (via drill 0.5)
  Top 0.406: C5.+ 55.77,12.84 56.71,13.78 | IC4.1 56.71,13.78 | 56.71,13.78 56.77,13.72 58.17,13.72 58.61,14.16 IC4.3 arc90 58.83,16.76 v60.2,16.76 | IC3.3 16.95,24.96 arc90 v17.02,24.89
  Top 0.61: C10.2 19.98,25.82 19.81,25.65 v19.05,24.89 | J1.8 45.72,5.08 45.47,5.33
  Top 0.813: 17.78,21.84 17.78,6.35 20.05,4.08 S2.POS 24.37,4.08 S3.1 26.16,5.33 45.47,5.33 50.55,5.33 54.86,9.65 54.86,11.18 55.51,11.18 C5.+ | 17.78,21.84 17.78,24.64 arc-90 v18.03,24.89 | v18.03,24.89 v17.02,24.89 | v18.03,24.89 v19.05,24.89 20.32,23.62 20.32,23.37 20.07,23.11 18.29,23.11 18.29,24.38 18.8,24.38 19.56,23.62 18.8,23.62 18.54,23.37 | C6.+ 17.92,22.47 17.78,21.84 | v18.29,26.67 v18.8,25.91 | v18.29,26.67 19.45,26.21 | 19.45,26.21 C10.2 | 19.45,26.21 18.8,25.4 17.27,25.4 17.27,25.91 v17.78,25.91 | v17.78,25.91 v18.29,26.67 | v18.29,26.67 18.29,25.65 v17.78,25.91 | 19.81,25.65 19.81,23.88
  Route2 0.406: JP1.1 60.2,37.59 v60.2,16.76
  Bottom 0.305: S5.29 S5.30
  Bottom 0.813: v17.02,24.89 v18.03,24.89 | v18.03,24.89 v19.05,24.89 v18.8,25.91 | v17.02,24.89 17.02,23.78 S5.26 S5.27 S5.28 S5.29 | v17.02,24.89 v17.78,25.91 | v17.78,25.91 v18.29,26.67 v18.8,25.91 | v18.8,25.91 v17.78,25.91 | v17.78,25.91 v18.03,24.89 | v18.03,24.89 18.54,25.4 | v18.03,24.89 17.53,24.13
XTL1
  Top 0.254: IC1.8 33.27,19.92 33.27,18.54 36.07,15.75 X1.1 38.7,14.52 38.7,14.22 | 38.7,14.22 R6.1 | C3.2 38.7,14.22
XTL2
  Top 0.254: IC1.7 32.64,19.99 X1.2 35.14,13.25 C2.2
  Top 0.406: C2.2 R6.2
(copper drawn outside any net)
  shapes: Bottom area x1

### Text on the board
tPlace: SCL | SDA | A | GND | 13 | 12 | 11 | 10 | 9 | 8 | 7 | 6 | 5 | 4 | 3 | 2 | 1 | 0 | PIEZO | REF | PWM | PWM | PWM | Digital | PWM | PWM | PWM | TX | RX | SPEAKER | ArduPhone2 | www.freetronics.com/phone | v1.2 | by Jonathan Oxer | www.freetronics.com/phone2 | -EN | A7 | RESET | 1 | freetronics | A6 | ATmega1284P / 3.3V 8MHz | 1 | OLED128 | USB | RX | TX | ICSP | RDY | (3V3) | CHG | PWR | D13 | CHRG | SJ4 | SJ5 | ArduPhone | MIC | Reset | IO | Power | Analog Inputs | MIC | 3.7V / LiPo | REF | RST | 3V3 | 5V | GND | GND | VIN | 0 | 1 | 2 | 3 | 4 | 5 | COL3 | COL2 | COL1 | ROW1 | ROW2 | ROW3 | ROW4 | ROW5 | ROW6 | GND | v2.0
bPlace: Charge Current | SCL | SDA | A | GND | 13 | 12 | 11 | 10 | 9 | 8 | 7 | 6 | 5 | 4 | 3 | 2 | 1 | 0 | REF | PWM | PWM | PWM | Digital | PWM | PWM | PWM | TX | RX | freetronics | (default) | 100mA / 200mA / 403mA / 503mA | SJ5 / Open / Closed / Open / Closed | SJ4 / Open / Open / Closed / Closed | A7 | A6 | ROHS | www.freetronics.com/phone | SKU: PHONE | IO | Power | Analog Inputs | REF | RST | 3V3 | 5V | GND | GND | VIN | 0 | 1 | 2 | 3 | 4 | 5 | 3.7V LiPo
tNames: IC2 | IC1 | S1
tRestrict: 3 | 6 | 9 | # | 2 | 5 | 8 | 0 | 1 | 4 | 7 | *
tDocu: A | K | A | K | A | K | A | K | A | K | A | K | A | K